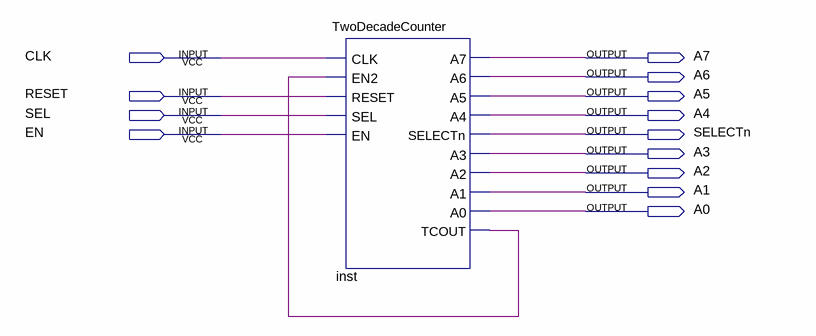
[diagram p0: schematic sheet]
// Quartus schematic Schematic.bdf as structural Verilog: 1 symbols, 13 pins
module Schematic (
  input  CLK,
  input  RESET,
  input  SEL,
  input  EN,
  output A7,
  output A6,
  output A5,
  output A4,
  output SELECTn,
  output A3,
  output A2,
  output A1,
  output A0
);

  wire inst_tcout;

  TwoDecadeCounter inst (
    .CLK(CLK), .EN2(inst_tcout), .RESET(RESET), .SEL(SEL), .EN(EN), .A7(A7), .A6(A6), .A5(A5), .A4(A4),
    .SELECTn(SELECTn), .A3(A3), .A2(A2), .A1(A1), .A0(A0), .TCOUT(inst_tcout));
endmodule
